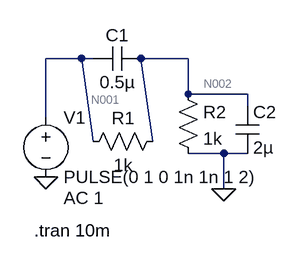
[diagram p0: schematic Draft6.asc]
Draft6.asc, the LTspice schematic file:
Version 4
SHEET 1 880 680
WIRE 96 48 48 48
WIRE 112 48 96 48
WIRE 240 48 176 48
WIRE 240 96 240 48
WIRE 320 96 240 96
WIRE 320 112 320 96
WIRE 48 128 48 48
WIRE 112 160 96 48
WIRE 192 160 176 48
WIRE 288 176 240 176
WIRE 320 176 288 176
WIRE 288 224 288 176
FLAG 288 224 0
FLAG 48 208 0
SYMBOL voltage 48 112 R0
WINDOW 123 24 124 Left 2
WINDOW 39 0 0 Left 0
SYMATTR InstName V1
SYMATTR Value PULSE(0 1 0 1n 1n 1 2)
SYMATTR Value2 AC 1
SYMBOL res 208 144 R90
WINDOW 0 0 56 VBottom 2
WINDOW 3 32 56 VTop 2
SYMATTR InstName R1
SYMATTR Value 1k
SYMBOL cap 176 32 R90
WINDOW 0 0 32 VBottom 2
WINDOW 3 32 32 VTop 2
SYMATTR InstName C1
SYMATTR Value 0.5µ
SYMBOL res 224 80 R0
SYMATTR InstName R2
SYMATTR Value 1k
SYMBOL cap 304 112 R0
SYMATTR InstName C2
SYMATTR Value 2µ
TEXT 32 280 Left 2 !.tran 10m

The netlist it stands for:
* Draft6.asc
V1 N001 0 PULSE(0 1 0 1n 1n 1 2) AC 1
R1 N002 N001 1k
C1 N002 N001 0.5µ
R2 N002 0 1k
C2 N002 0 2µ
.tran 10m
.backanno
.end

* Results of the author's LTspice run, read from the files saved beside the schematic
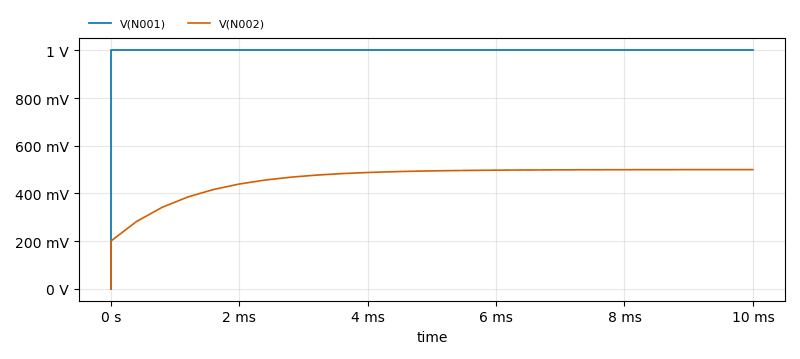
[diagram p1: Transient Analysis of Draft6.asc, plotted from the saved traces]
* Transient Analysis, 1 run:
*   V(N001): min 0 V, max 1 V, average 1 V, rms 1 V, last 1 V
*   V(N002): min 0 V, max 499.9 mV, average 462.2 mV, rms 466.9 mV, last 499.9 mV